# EAGLE design Shield (EAGLE 9.6.2)

## Sheet 1 of 2
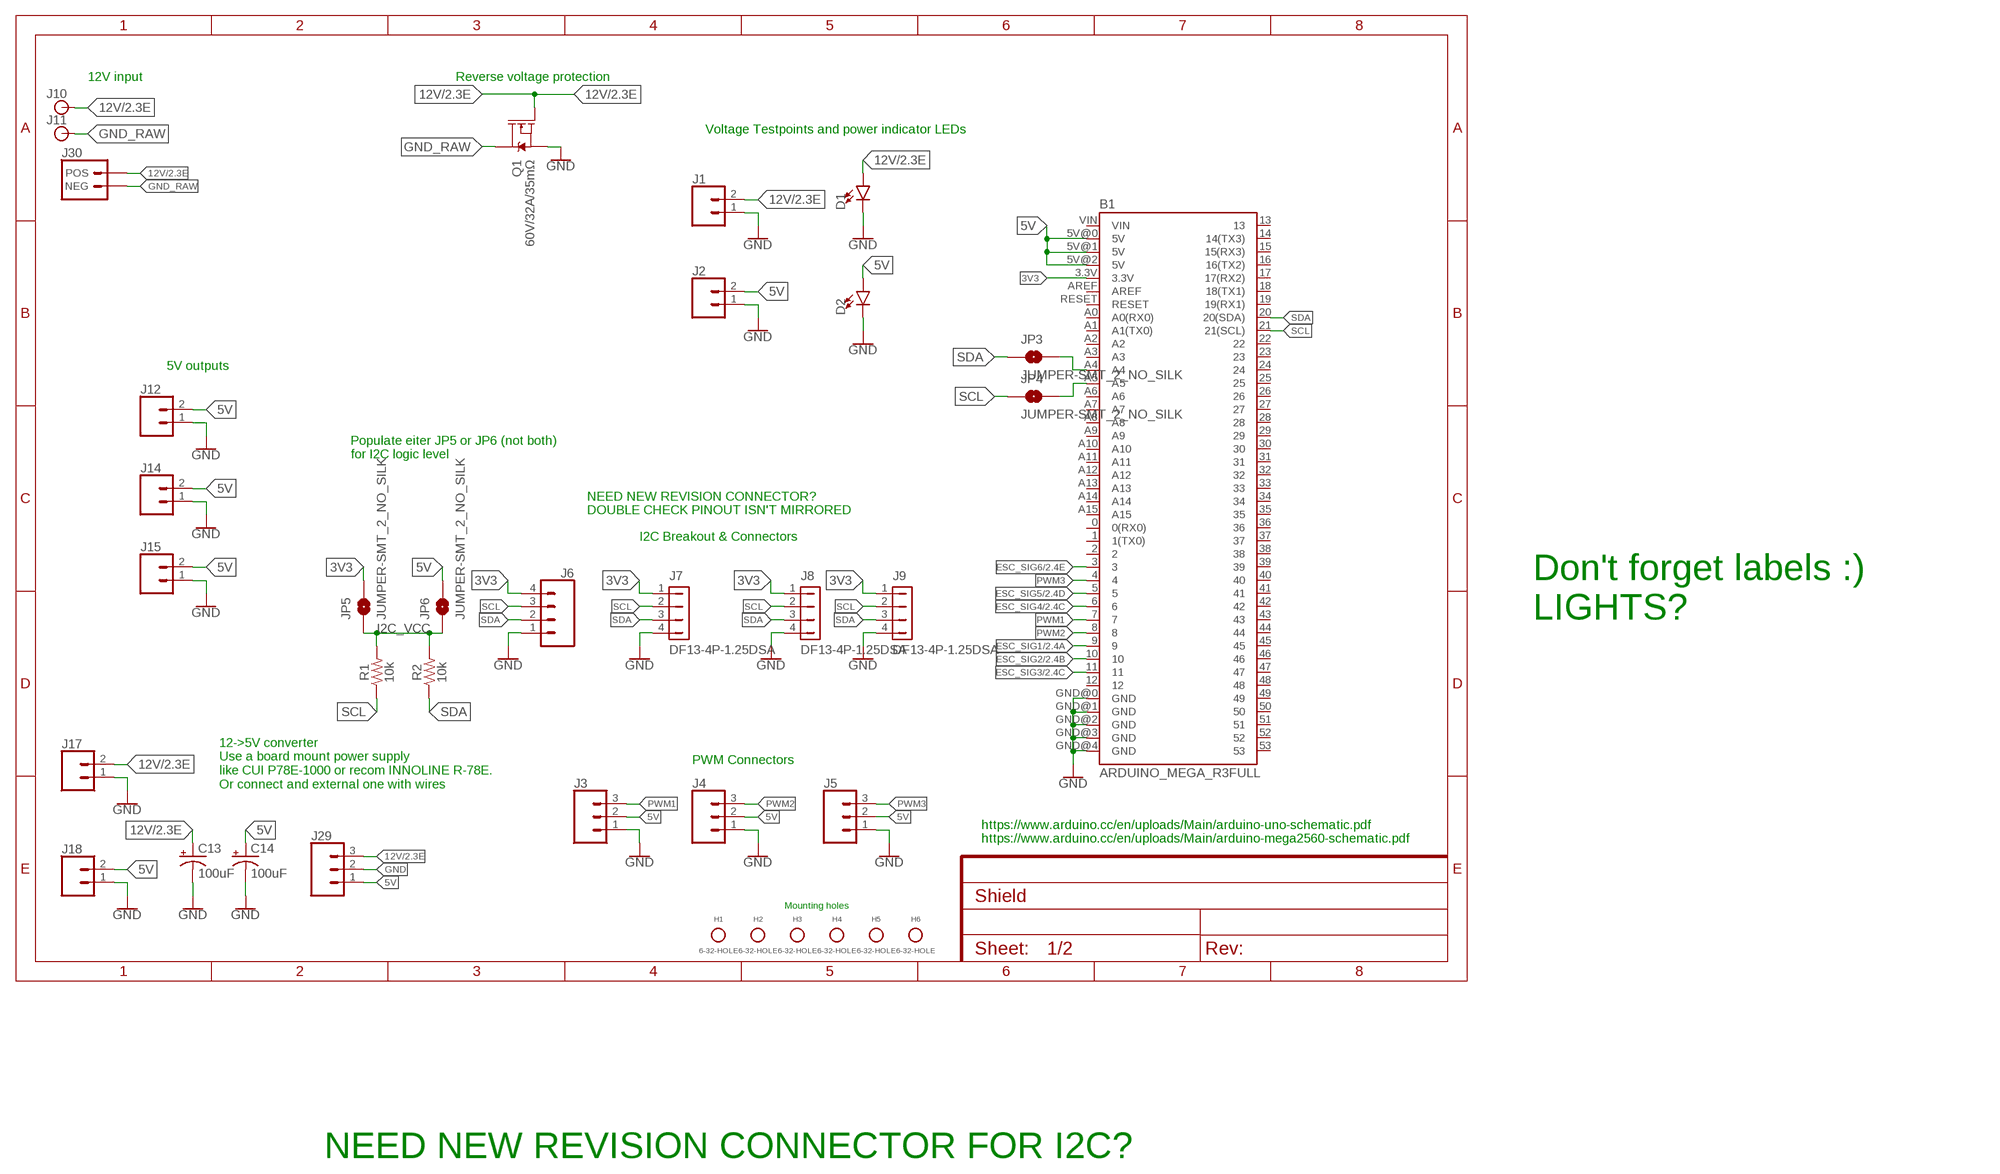
[diagram p0: schematic, sheet 1]

### Parts
B1  ARDUINO_MEGA_R3FULL  [ARDUINO_MEGA]
C13  100uF  100UF-POLAR-RADIAL-2.5MM-25V-20%  [CPOL-RADIAL-2.5MM-6.5MM]
C14  100uF  100UF-POLAR-RADIAL-2.5MM-25V-20%  [CPOL-RADIAL-2.5MM-6.5MM]
D1  LED3MM  [LED_3MM]
D2  LED3MM  [LED_3MM]
H1  6-32-HOLE  [6-32-HOLE]
H2  6-32-HOLE  [6-32-HOLE]
H3  6-32-HOLE  [6-32-HOLE]
H4  6-32-HOLE  [6-32-HOLE]
H5  6-32-HOLE  [6-32-HOLE]
H6  6-32-HOLE  [6-32-HOLE]
J1  CONN_02  [1X02]
J2  CONN_02  [1X02]
J3  CONN_03  [1X03]
J4  CONN_03  [1X03]
J5  CONN_03  [1X03]
J6  CONN_04  [1X04]
J7  DF13-4P-1.25DSA  [DF13-4P-1.25DSA]
J8  DF13-4P-1.25DSA  [DF13-4P-1.25DSA]
J9  DF13-4P-1.25DSA  [DF13-4P-1.25DSA]
J10  BANANA_PTH  [BANANA_CONN_NO_THERM]
J11  BANANA_PTH  [BANANA_CONN_NO_THERM]
J12  CONN_02  [1X02]
J14  CONN_02  [1X02]
J15  CONN_02  [1X02]
J17  CONN_02  [1X02]
J18  CONN_02  [1X02]
J29  CONN_03  [1X03]
J30  ANDERON_POWERPOLE_2  [ANDERON_POWERPOLE_2]
JP3  JUMPER-SMT_2_NO_SILK  [SMT-JUMPER_2_NO_SILK]
JP4  JUMPER-SMT_2_NO_SILK  [SMT-JUMPER_2_NO_SILK]
JP5  JUMPER-SMT_2_NO_SILK  [SMT-JUMPER_2_NO_SILK]
JP6  JUMPER-SMT_2_NO_SILK  [SMT-JUMPER_2_NO_SILK]
Q1  60V/32A/35mΩ  MOSFET-NCH-FQP30N06L  [TO220V]
R1  10k  10KOHM-HORIZ-1/4W-5%  [AXIAL-0.3]
R2  10k  10KOHM-HORIZ-1/4W-5%  [AXIAL-0.3]

### Nets
3V3 [power]: B1.3.3V J6.4 J7.1 J8.1 J9.1 JP5.2
5V [power]: B1.5V@0(5V) B1.5V@1(5V) B1.5V@2(5V) C14.1(+) D2.A J2.2 J3.2 J4.2 J5.2 J12.2 J14.2 J15.2 J18.2 J29.1 JP6.2
12V: C13.1(+) D1.A J1.2 J10.1 J17.2 J29.3 J30.POS Q1.1(G) ; also sheet 2
A4_SDA: B1.A4 JP3.2
A5_SCL: B1.A5 JP4.2
ESC_SIG1: B1.9 ; also sheet 2
ESC_SIG2: B1.10 ; also sheet 2
ESC_SIG3: B1.11 ; also sheet 2
ESC_SIG4: B1.6 ; also sheet 2
ESC_SIG5: B1.5 ; also sheet 2
ESC_SIG6: B1.3 ; also sheet 2
GND: B1.GND@0(GND) B1.GND@1(GND) B1.GND@2(GND) B1.GND@3(GND) B1.GND@4(GND) C13.2(-) C14.2(-) D1.K(C) D2.K(C) J1.1 J2.1 J3.1 J4.1 J5.1 J6.1 J7.4 J8.4 J9.4 J12.1 J14.1 J15.1 J17.1 J18.1 J29.2 Q1.3(S) ; also sheet 2
GND_RAW: J11.1 J30.NEG Q1.2(D)
I2C_VCC: JP5.1 JP6.1 R1.P$2 R2.P$2
PWM1: B1.7 J3.3
PWM2: B1.8 J4.3
PWM3: B1.4 J5.3
SCL: B1.21(21(SCL)) J6.3 J7.2 J8.2 J9.2 JP4.1 R1.P$1
SDA: B1.20(20(SDA)) J6.2 J7.3 J8.3 J9.3 JP3.1 R2.P$1
Unconnected: B1.0(0(RX0)) B1.1(1(TX0)) B1.2 B1.12 B1.13 B1.14(14(TX3)) B1.15(15(RX3)) B1.16(16(TX2)) B1.17(17(RX2)) B1.18(18(TX1)) B1.19(19(RX1)) B1.22 B1.23 B1.24 B1.25 B1.26 B1.27 B1.28 B1.29 B1.30 B1.31 B1.32 B1.33 B1.34 B1.35 B1.36 B1.37 B1.38 B1.39 B1.40 B1.41 B1.42 B1.43 B1.44 B1.45 B1.46 B1.47 B1.48 B1.49 B1.50 B1.51 B1.52 B1.53 B1.A0(A0(RX0)) B1.A1(A1(TX0)) B1.A2 B1.A3 B1.A6 B1.A7 B1.A8 B1.A9 B1.A10 B1.A11 B1.A12 B1.A13 B1.A14 B1.A15 B1.AREF B1.RESET B1.VIN

### Notes on the sheet
- 12V input | Reverse voltage protection
- Voltage Testpoints and power indicator LEDs
- 5V outputs
- Populate eiter JP5 or JP6 (not both)
  for I2C logic level
- NEED NEW REVISION CONNECTOR?
  DOUBLE CHECK PINOUT ISN'T MIRRORED
- I2C Breakout & Connectors
- Don't forget labels :)
  LIGHTS?
- 12->5V converter
  Use a board mount power supply
  like CUI P78E-1000 or recom INNOLINE R-78E.
  Or connect and external one with wires
- PWM Connectors
- https://www.arduino.cc/en/uploads/Main/arduino-uno-schematic.pdf
  https://www.arduino.cc/en/uploads/Main/arduino-mega2560-schematic.pdf
- Mounting holes
- NEED NEW REVISION CONNECTOR FOR I2C?

## Sheet 2 of 2
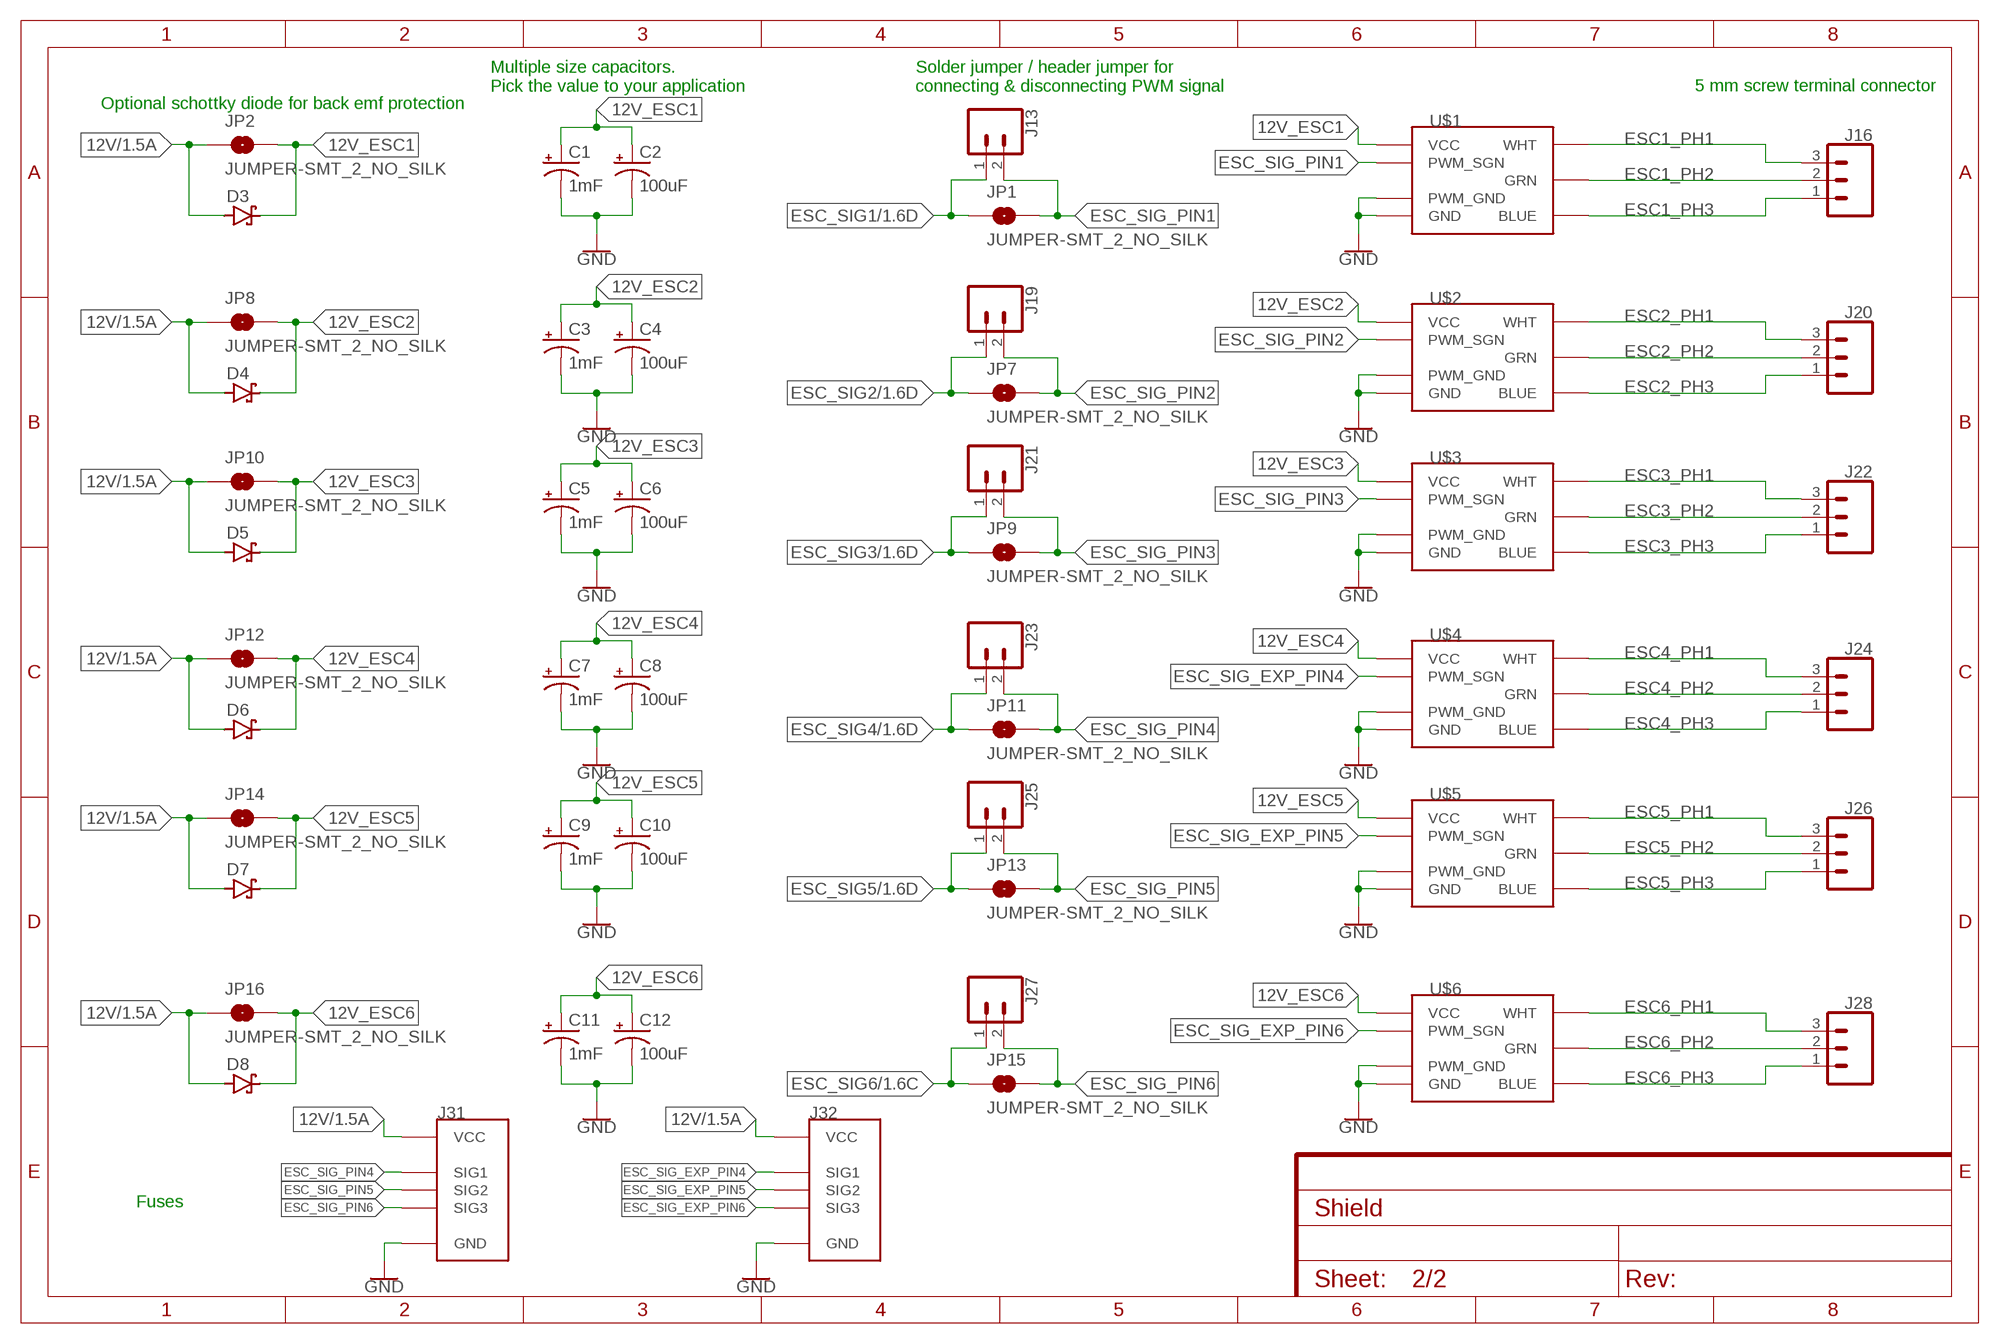
[diagram p1: schematic, sheet 2]

### Parts
C1  1mF  1000UF-RADIAL-5MM-25V-20%  [CPOL-RADIAL-5MM-10MM]
C2  100uF  100UF-POLAR-RADIAL-2.5MM-25V-20%  [CPOL-RADIAL-2.5MM-6.5MM]
C3  1mF  1000UF-RADIAL-5MM-25V-20%  [CPOL-RADIAL-5MM-10MM]
C4  100uF  100UF-POLAR-RADIAL-2.5MM-25V-20%  [CPOL-RADIAL-2.5MM-6.5MM]
C5  1mF  1000UF-RADIAL-5MM-25V-20%  [CPOL-RADIAL-5MM-10MM]
C6  100uF  100UF-POLAR-RADIAL-2.5MM-25V-20%  [CPOL-RADIAL-2.5MM-6.5MM]
C7  1mF  1000UF-RADIAL-5MM-25V-20%  [CPOL-RADIAL-5MM-10MM]
C8  100uF  100UF-POLAR-RADIAL-2.5MM-25V-20%  [CPOL-RADIAL-2.5MM-6.5MM]
C9  1mF  1000UF-RADIAL-5MM-25V-20%  [CPOL-RADIAL-5MM-10MM]
C10  100uF  100UF-POLAR-RADIAL-2.5MM-25V-20%  [CPOL-RADIAL-2.5MM-6.5MM]
C11  1mF  1000UF-RADIAL-5MM-25V-20%  [CPOL-RADIAL-5MM-10MM]
C12  100uF  100UF-POLAR-RADIAL-2.5MM-25V-20%  [CPOL-RADIAL-2.5MM-6.5MM]
D3  SCHOTTKY-DIODECB429-15  [CB429-15]
D4  SCHOTTKY-DIODECB429-15  [CB429-15]
D5  SCHOTTKY-DIODECB429-15  [CB429-15]
D6  SCHOTTKY-DIODECB429-15  [CB429-15]
D7  SCHOTTKY-DIODECB429-15  [CB429-15]
D8  SCHOTTKY-DIODECB429-15  [CB429-15]
J13  CONN_02  [1X02]
J16  CONN_03-SCREW-5MM  [SCREWTERMINAL-5MM-3]
J19  CONN_02  [1X02]
J20  CONN_03-SCREW-5MM  [SCREWTERMINAL-5MM-3]
J21  CONN_02  [1X02]
J22  CONN_03-SCREW-5MM  [SCREWTERMINAL-5MM-3]
J23  CONN_02  [1X02]
J24  CONN_03-SCREW-5MM  [SCREWTERMINAL-5MM-3]
J25  CONN_02  [1X02]
J26  CONN_03-SCREW-5MM  [SCREWTERMINAL-5MM-3]
J27  CONN_02  [1X02]
J28  CONN_03-SCREW-5MM  [SCREWTERMINAL-5MM-3]
J31  ESC_EXPANSION_CONNECTOR  [EXPANSION]
J32  ESC_EXPANSION_CONNECTOR  [EXPANSION]
JP1  JUMPER-SMT_2_NO_SILK  [SMT-JUMPER_2_NO_SILK]
JP2  JUMPER-SMT_2_NO_SILK  [SMT-JUMPER_2_NO_SILK]
JP7  JUMPER-SMT_2_NO_SILK  [SMT-JUMPER_2_NO_SILK]
JP8  JUMPER-SMT_2_NO_SILK  [SMT-JUMPER_2_NO_SILK]
JP9  JUMPER-SMT_2_NO_SILK  [SMT-JUMPER_2_NO_SILK]
JP10  JUMPER-SMT_2_NO_SILK  [SMT-JUMPER_2_NO_SILK]
JP11  JUMPER-SMT_2_NO_SILK  [SMT-JUMPER_2_NO_SILK]
JP12  JUMPER-SMT_2_NO_SILK  [SMT-JUMPER_2_NO_SILK]
JP13  JUMPER-SMT_2_NO_SILK  [SMT-JUMPER_2_NO_SILK]
JP14  JUMPER-SMT_2_NO_SILK  [SMT-JUMPER_2_NO_SILK]
JP15  JUMPER-SMT_2_NO_SILK  [SMT-JUMPER_2_NO_SILK]
JP16  JUMPER-SMT_2_NO_SILK  [SMT-JUMPER_2_NO_SILK]
U$1  ESC  [ESC]
U$2  ESC  [ESC]
U$3  ESC  [ESC]
U$4  ESC  [ESC]
U$5  ESC  [ESC]
U$6  ESC  [ESC]

### Nets
12V: D3.A D4.A D5.A D6.A D7.A D8.A J31.15(VCC) J31.16(VCC) J31.17(VCC) J31.18(VCC) J31.19(VCC) J31.20(VCC) J31.21(VCC) J31.22(VCC) J31.23(VCC) J31.24(VCC) J32.15(VCC) J32.16(VCC) J32.17(VCC) J32.18(VCC) J32.19(VCC) J32.20(VCC) J32.21(VCC) J32.22(VCC) J32.23(VCC) J32.24(VCC) JP2.1 JP8.1 JP10.1 JP12.1 JP14.1 JP16.1 ; also sheet 1
12V_ESC1: C1.+ C2.1(+) D3.C JP2.2 U$1.VCC
12V_ESC2: C3.+ C4.1(+) D4.C JP8.2 U$2.VCC
12V_ESC3: C5.+ C6.1(+) D5.C JP10.2 U$3.VCC
12V_ESC4: C7.+ C8.1(+) D6.C JP12.2 U$4.VCC
12V_ESC5: C9.+ C10.1(+) D7.C JP14.2 U$5.VCC
12V_ESC6: C11.+ C12.1(+) D8.C JP16.2 U$6.VCC
ESC1_PH1: J16.3 U$1.BLUE(WHT)
ESC1_PH2: J16.2 U$1.GRN
ESC1_PH3: J16.1 U$1.WHT(BLUE)
ESC2_PH1: J20.3 U$2.BLUE(WHT)
ESC2_PH2: J20.2 U$2.GRN
ESC2_PH3: J20.1 U$2.WHT(BLUE)
ESC3_PH1: J22.3 U$3.BLUE(WHT)
ESC3_PH2: J22.2 U$3.GRN
ESC3_PH3: J22.1 U$3.WHT(BLUE)
ESC4_PH1: J24.3 U$4.BLUE(WHT)
ESC4_PH2: J24.2 U$4.GRN
ESC4_PH3: J24.1 U$4.WHT(BLUE)
ESC5_PH1: J26.3 U$5.BLUE(WHT)
ESC5_PH2: J26.2 U$5.GRN
ESC5_PH3: J26.1 U$5.WHT(BLUE)
ESC6_PH1: J28.3 U$6.BLUE(WHT)
ESC6_PH2: J28.2 U$6.GRN
ESC6_PH3: J28.1 U$6.WHT(BLUE)
ESC_SIG1: J13.1 JP1.1 ; also sheet 1
ESC_SIG2: J19.1 JP7.1 ; also sheet 1
ESC_SIG3: J21.1 JP9.1 ; also sheet 1
ESC_SIG4: J23.1 JP11.1 ; also sheet 1
ESC_SIG5: J25.1 JP13.1 ; also sheet 1
ESC_SIG6: J27.1 JP15.1 ; also sheet 1
ESC_SIG_EXP_PIN4: J32.11(SIG1) U$4.PWM_SGN
ESC_SIG_EXP_PIN5: J32.12(SIG2) U$5.PWM_SGN
ESC_SIG_EXP_PIN6: J32.13(SIG3) U$6.PWM_SGN
ESC_SIG_PIN1: J13.2 JP1.2 U$1.PWM_SGN
ESC_SIG_PIN2: J19.2 JP7.2 U$2.PWM_SGN
ESC_SIG_PIN3: J21.2 JP9.2 U$3.PWM_SGN
ESC_SIG_PIN4: J23.2 J31.11(SIG1) JP11.2
ESC_SIG_PIN5: J25.2 J31.12(SIG2) JP13.2
ESC_SIG_PIN6: J27.2 J31.13(SIG3) JP15.2
GND: C1.- C2.2(-) C3.- C4.2(-) C5.- C6.2(-) C7.- C8.2(-) C9.- C10.2(-) C11.- C12.2(-) J31.1(GND) J31.2(GND) J31.3(GND) J31.4(GND) J31.5(GND) J31.6(GND) J31.7(GND) J31.8(GND) J31.9(GND) J31.10(GND) J32.1(GND) J32.2(GND) J32.3(GND) J32.4(GND) J32.5(GND) J32.6(GND) J32.7(GND) J32.8(GND) J32.9(GND) J32.10(GND) U$1.GND U$1.PWM_GND U$2.GND U$2.PWM_GND U$3.GND U$3.PWM_GND U$4.GND U$4.PWM_GND U$5.GND U$5.PWM_GND U$6.GND U$6.PWM_GND ; also sheet 1

### Notes on the sheet
- Multiple size capacitors.
  Pick the value to your application
- Solder jumper / header jumper for
  connecting & disconnecting PWM signal
- 5 mm screw terminal connector
- Optional schottky diode for back emf protection
- Fuses

## Library data of the parts
B1 = SparkFun-Boards:ARDUINO_MEGA_R3: Arduino Mega R3 ATmega2560 R3 compatible footprint. SparkFun Products: Arduino Mega 2560 R3 <https://www.sparkfun.com/products/11061>
C1 C3 C5 C7 C9 C11 = SparkFun-Capacitors:1000UF: 1,000µF/1mF ceramic capacitors A capacitor is a passive two-terminal electrical component used to store electrical energy temporarily in an electric field. CAP-08070; PROD_ID: CAP-09538
C2 C4 C6 C8 C10 C12-C14 = SparkFun-Capacitors:100UF-POLAR: 100µF polarized capacitors A capacitor is a passive two-terminal electrical component used to store electrical energy temporarily in an electric field.; PROD_ID: CAP-08439
D1 D2 = SparkFun-LED:LED: LED (Generic) Standard schematic elements and footprints for 5mm, 3mm, 1206, and 0603 sized LEDs. Generic LEDs with no color specified.; PROD_ID: DIO-08794
D3-D8 = diode:SCHOTTKY-DIODE: Schottky Diode
H1-H6 = Mounting Holes:6-32-HOLE
J1 J2 J12-J15 J17-J19 J21 J23 J25 J27 = SparkFun-Connectors:CONN_02: Multi connection point. Often used as Generic Header-pin footprint for 0.1 inch spaced/style header connections On any of the 0.1 inch spaced packages, you can populate with these: Break Away Headers - Straight <https://www.sparkfun.com/products/116> (PRT-00116) Break Away Male Headers - Right Angle <https://www.sparkfun.com/products/553> (PRT-00553) Female Headers <https://www.sparkfun.com/products/115> (PRT-00115) Break Away Headers - Machine Pin <https://www.sparkfun.com/products/117> (PRT-00117) Break Away Female Headers - Swiss Machine Pin <https://www.sparkfun.com/products/743> (PRT-00743) For SCREWTERMINALS and SPRING TERMINALS visit here: Screw Terimnals on SparkFun.com <https://www.sparkfun.com/search/results?term=Screw+Terminals> (5mm/3.5mm/2.54mm spacing) This device is also useful as a general connection point to wire up your design to another part of your project. Our various solder wires solder well into these plated through hole pads. Hook-Up Wire - Assortment (Stranded, 22 AWG) <https://www.sparkfun.com/products/11375> (PRT-11375) Hook-Up Wire - Assortment (Solid Core, 22 AWG) <https://www.sparkfun.com/products/11367> (PRT-11367) View the entire wire category on our website here <https://www.sparkfun.com/categories/141> Special notes: Molex polarized connector foot print use with: PRT-08233 with associated crimp pins and housings. 2.54_SCREWTERM for use with PRT-10571. 3.5mm Screw Terminal footprints for PRT-08084 5mm Screw Terminal footprints for use with PRT-08432
J3-J5 J29 = SparkFun-Connectors:CONN_03: Multi connection point. Often used as Generic Header-pin footprint for 0.1 inch spaced/style header connections On any of the 0.1 inch spaced packages, you can populate with these: Break Away Headers - Straight <https://www.sparkfun.com/products/116> (PRT-00116) Break Away Male Headers - Right Angle <https://www.sparkfun.com/products/553> (PRT-00553) Female Headers <https://www.sparkfun.com/products/115> (PRT-00115) Break Away Headers - Machine Pin <https://www.sparkfun.com/products/117> (PRT-00117) Break Away Female Headers - Swiss Machine Pin <https://www.sparkfun.com/products/743> (PRT-00743) Stackable Header - 3 Pin (Female, 0.1") <https://www.sparkfun.com/products/13875> (PRT-13875) For SCREWTERMINALS and SPRING TERMINALS visit here: Screw Terimnals on SparkFun.com <https://www.sparkfun.com/search/results?term=Screw+Terminals> (5mm/3.5mm/2.54mm spacing) This device is also useful as a general connection point to wire up your design to another part of your project. Our various solder wires solder well into these plated through hole pads. Hook-Up Wire - Assortment (Stranded, 22 AWG) <https://www.sparkfun.com/products/11375> (PRT-11375) Hook-Up Wire - Assortment (Solid Core, 22 AWG) <https://www.sparkfun.com/products/11367> (PRT-11367) View the entire wire category on our website here <https://www.sparkfun.com/categories/141> Special notes: Molex polarized connector foot print use with SKU : PRT-08232 with associated crimp pins and housings.
J6 = SparkFun-Connectors:CONN_04: Multi connection point. Often used as Generic Header-pin footprint for 0.1 inch spaced/style header connections On any of the 0.1 inch spaced packages, you can populate with these: Break Away Headers - Straight <https://www.sparkfun.com/products/116> (PRT-00116) Break Away Male Headers - Right Angle <https://www.sparkfun.com/products/553> (PRT-00553) Female Headers <https://www.sparkfun.com/products/115> (PRT-00115) Break Away Headers - Machine Pin <https://www.sparkfun.com/products/117> (PRT-00117) Break Away Female Headers - Swiss Machine Pin <https://www.sparkfun.com/products/743> (PRT-00743) For SCREWTERMINALS and SPRING TERMINALS visit here: Screw Terimnals on SparkFun.com <https://www.sparkfun.com/search/results?term=Screw+Terminals> (5mm/3.5mm/2.54mm spacing) This device is also useful as a general connection point to wire up your design to another part of your project. Our various solder wires solder well into these plated through hole pads. Hook-Up Wire - Assortment (Stranded, 22 AWG) <https://www.sparkfun.com/products/11375> (PRT-11375) Hook-Up Wire - Assortment (Solid Core, 22 AWG) <https://www.sparkfun.com/products/11367> (PRT-11367) View the entire wire category on our website here <https://www.sparkfun.com/categories/141> Special notes: Molex polarized connector foot print use with SKU : PRT-08231 with associated crimp pins and housings. 1MM SMD Version SKU: PRT-10208; PROD_ID: CONN-09696
J7-J9 = con-hirose-df13:DF13-4P-1.25: DF13-4P 1.25mm Pitch Miniature Crimping Connector.
J10 J11 = Banana Plug PTH:BANANA_PTH
J16 J20 J22 J24 J26 J28 = SparkFun-Connectors:CONN_03: Multi connection point. Often used as Generic Header-pin footprint for 0.1 inch spaced/style header connections On any of the 0.1 inch spaced packages, you can populate with these: Break Away Headers - Straight <https://www.sparkfun.com/products/116> (PRT-00116) Break Away Male Headers - Right Angle <https://www.sparkfun.com/products/553> (PRT-00553) Female Headers <https://www.sparkfun.com/products/115> (PRT-00115) Break Away Headers - Machine Pin <https://www.sparkfun.com/products/117> (PRT-00117) Break Away Female Headers - Swiss Machine Pin <https://www.sparkfun.com/products/743> (PRT-00743) Stackable Header - 3 Pin (Female, 0.1") <https://www.sparkfun.com/products/13875> (PRT-13875) For SCREWTERMINALS and SPRING TERMINALS visit here: Screw Terimnals on SparkFun.com <https://www.sparkfun.com/search/results?term=Screw+Terminals> (5mm/3.5mm/2.54mm spacing) This device is also useful as a general connection point to wire up your design to another part of your project. Our various solder wires solder well into these plated through hole pads. Hook-Up Wire - Assortment (Stranded, 22 AWG) <https://www.sparkfun.com/products/11375> (PRT-11375) Hook-Up Wire - Assortment (Solid Core, 22 AWG) <https://www.sparkfun.com/products/11367> (PRT-11367) View the entire wire category on our website here <https://www.sparkfun.com/categories/141> Special notes: Molex polarized connector foot print use with SKU : PRT-08232 with associated crimp pins and housings.; PROD_ID: CONN-10134; SF_SKU: PRT-08433
J30 = Anderson PP:ANDERON_POWERPOLE_2
J31 J32 = Esc Expansion:ESC_EXPANSION_CONNECTOR
JP1-JP16 = SparkFun-Jumpers:JUMPER-SMT_2_NO: Normally open jumper This jumper has two pads in close proximity to each other. Apply solder to close the connection. Round pads are easier to solder for beginners, but are a lot larger. SparkFun Product that uses the round pads: SparkFun EL Sequencer <https://www.sparkfun.com/products/12781>
Q1 = SparkFun-DiscreteSemi:MOSFET-NCH: N-channel MOSFETs Voltage controlled devices that allow control of high current outputs. SparkFun Products: SparkFun OpenScale <https://www.sparkfun.com/products/13261> SparkFun Digital Sandbox <https://www.sparkfun.com/products/12651> SparkFun Monster Moto Shield <https://www.sparkfun.com/products/10182> SparkFun MOSFET Power Controller <https://www.sparkfun.com/products/11214>; PROD_ID: TRANS-10060
R1 R2 = SparkFun-Resistors:10KOHM: 10kΩ resistor A resistor is a passive two-terminal electrical component that implements electrical resistance as a circuit element. Resistors act to reduce current flow, and, at the same time, act to lower voltage levels within circuits. - Wikipedia; PROD_ID: RES-09435
U$1-U$6 = ESC:ESC

## Net classes
0 default: width 0.254 mm, clearance 0.254 mm
1 power: width 0.762 mm, clearance 0.254 mm

## Board
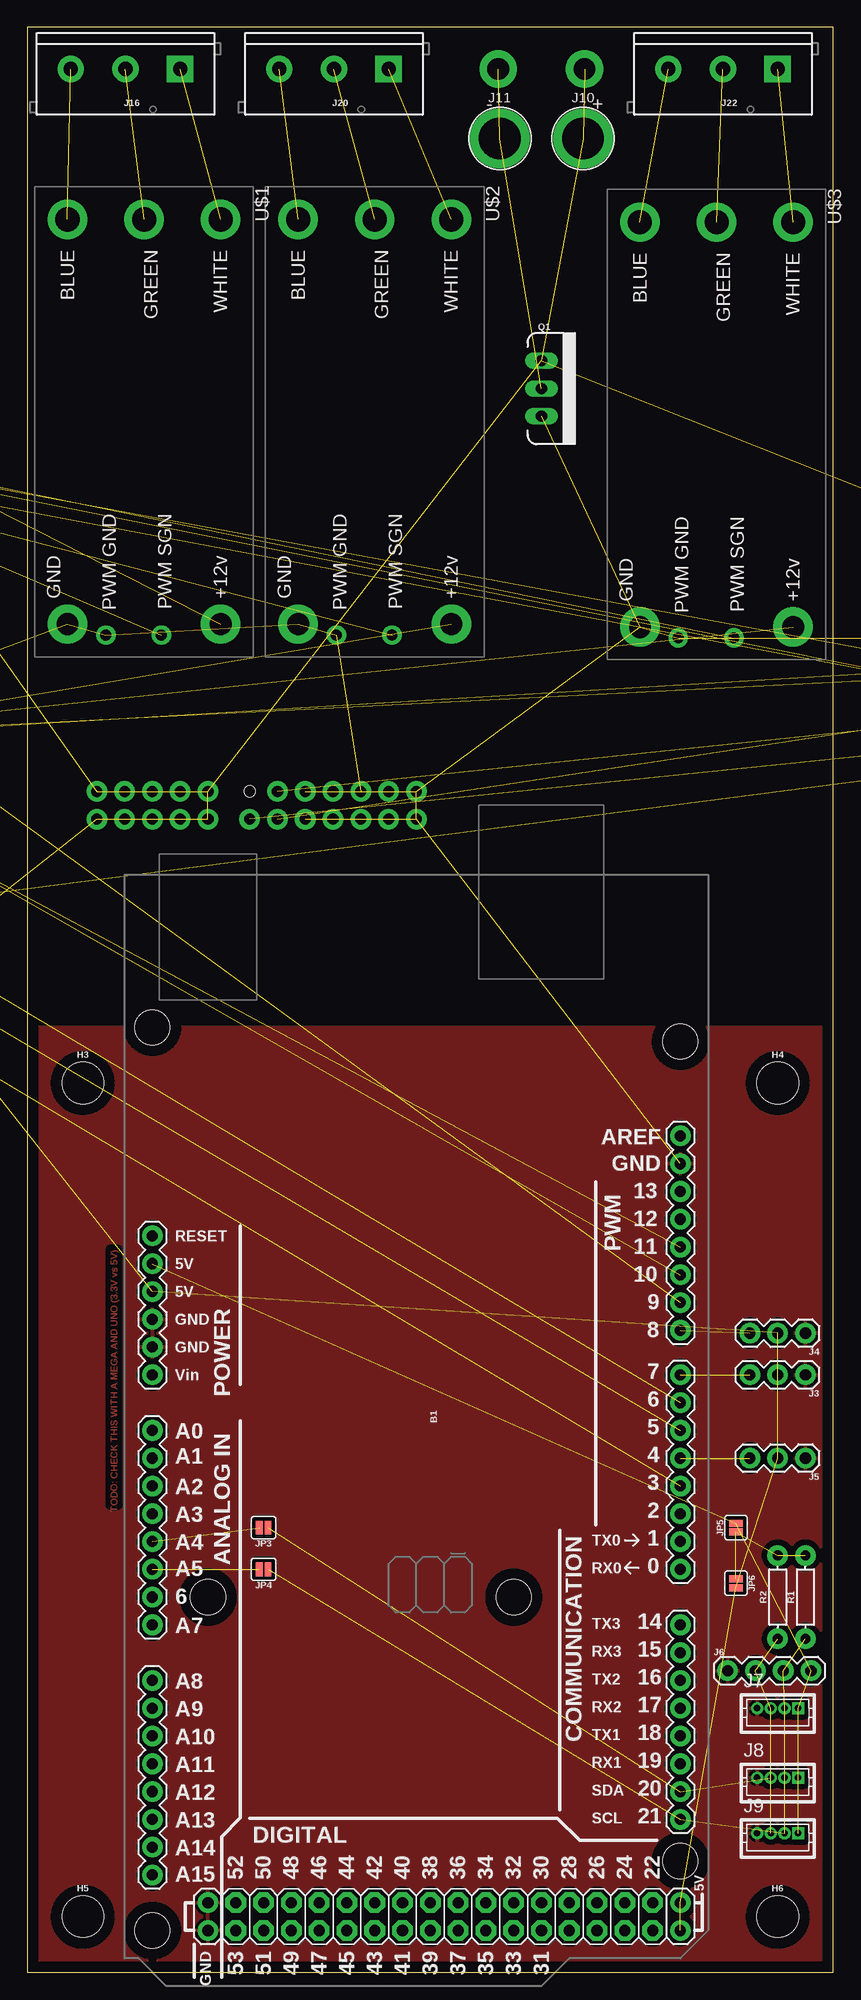
[diagram p2: board, top side]
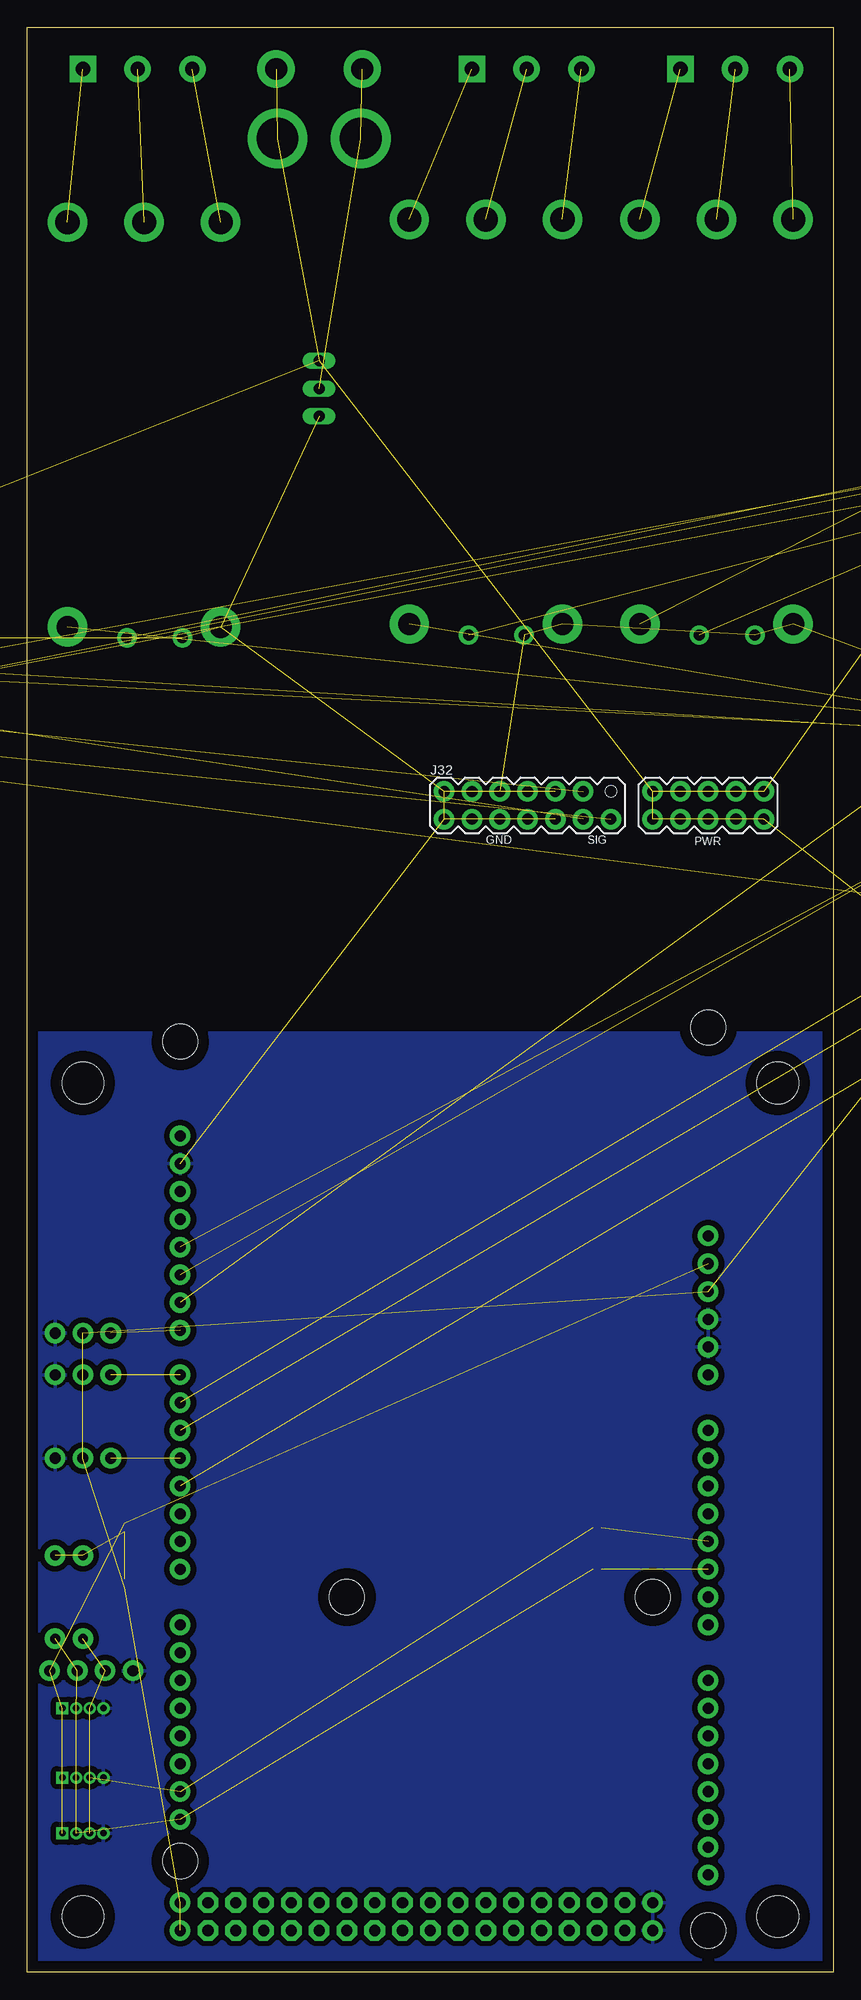
[diagram p3: board, bottom side, seen from below]

Size 73.66 x 177.8 mm. Coordinates in mm from the lower left corner, seen from the top.
Outline: 0,0 73.66,0 73.66,177.8 0,177.8 0,0
Copper layers (1*16): Top 0.035mm / dielectric 1.5mm / Bottom 0.035mm
Design rules "default": minimum track width 6mil, minimum drill 0.35mm, track to track 6mil, track to pad 6mil, pad to pad 6mil, via to via 6mil, smd to smd 6mil, copper to edge 40mil, drill to drill 6mil, minimum pad ring 10mil, minimum via ring 8mil, stop-mask expansion 4mil, vias tented up to drill 0mil, thermal gap 10mil

### Footprints (pad centres in the part's own frame; a part is rotated, then mirrored left to right if it is on the bottom)
ARDUINO_MEGA = drill 1.016 pad 1.88: 0 13.97,24.13; 1 11.43,24.13; 2 8.89,24.13; 3 6.35,24.13; 3.3V -13.97,-24.13; 4 3.81,24.13; 5 1.27,24.13; 5V@0 -11.43,-24.13; 5V@1 44.45,24.13; 5V@2 46.99,24.13; 6 -1.27,24.13; 7 -3.81,24.13; 8 -7.874,24.13; 9 -10.414,24.13; 10 -12.954,24.13; 11 -15.494,24.13; 12 -18.034,24.13; 13 -20.574,24.13; 14 19.05,24.13; 15 21.59,24.13; 16 24.13,24.13; 17 26.67,24.13; 18 29.21,24.13; 19 31.75,24.13; 20 34.29,24.13; 21 36.83,24.13; A0 1.27,-24.13; A1 3.81,-24.13; A2 6.35,-24.13; A3 8.89,-24.13; A4 11.43,-24.13; A5 13.97,-24.13; A6 16.51,-24.13; A7 19.05,-24.13; A8 24.13,-24.13; A9 26.67,-24.13; A10 29.21,-24.13; A11 31.75,-24.13; A12 34.29,-24.13; A13 36.83,-24.13; A14 39.37,-24.13; A15 41.91,-24.13; AREF -25.654,24.13; GND@0 -8.89,-24.13; GND@1 -6.35,-24.13; GND@2 44.45,-19.05; GND@3 46.99,-19.05; GND@4 -23.114,24.13; RESET -16.51,-24.13; VIN -3.81,-24.13 | drill 1.016 pad 1.88 octagon: 22 44.45,21.59; 23 46.99,21.59; 24 44.45,19.05; 25 46.99,19.05; 26 44.45,16.51; 27 46.99,16.51; 28 44.45,13.97; 29 46.99,13.97; 30 44.45,11.43; 31 46.99,11.43; 32 44.45,8.89; 33 46.99,8.89; 34 44.45,6.35; 35 46.99,6.35; 36 44.45,3.81; 37 46.99,3.81; 38 44.45,1.27; 39 46.99,1.27; 40 44.45,-1.27; 41 46.99,-1.27; 42 44.45,-3.81; 43 46.99,-3.81; 44 44.45,-6.35; 45 46.99,-6.35; 46 44.45,-8.89; 47 46.99,-8.89; 48 44.45,-11.43; 49 46.99,-11.43; 50 44.45,-13.97; 51 46.99,-13.97; 52 44.45,-16.51; 53 46.99,-16.51 | hole 3.2: -34.29,24.13; -35.56,-24.13; 16.51,8.89; 16.51,-19.05; 40.64,24.13; 46.99,-24.13
CPOL-RADIAL-5MM-10MM = drill 0.9 pad 1.93 square: + 2.5,0 | drill 0.9 pad 1.93: - -2.5,0
CPOL-RADIAL-2.5MM-6.5MM = drill 0.7 pad 1.651 square: 1 1.25,0 | drill 0.7 pad 1.651: 2 -1.25,0
LED_3MM = drill 0.813 pad 1.88: A -1.27,0; K 1.27,0
CB429-15 = drill 1.397 long: A 7.62,0; C -7.62,0
6-32-HOLE = hole 3.81: 0,0
1X02 = drill 1.016 pad 1.88: 1 0,0; 2 2.54,0
1X03 = drill 1.016 pad 1.88: 1 0,0; 2 2.54,0; 3 5.08,0
1X04 = drill 1.016 pad 1.88: 1 0,0; 2 2.54,0; 3 5.08,0; 4 7.62,0
DF13-4P-1.25DSA = drill 0.6 pad 1.016 square: 1 1.875,0 | drill 0.6 pad 1.016: 2 0.625,0; 3 -0.625,0; 4 -1.875,0
BANANA_CONN_NO_THERM = drill 3.81 pad 5.461: 1 0,0
SCREWTERMINAL-5MM-3 = drill 1.3 pad 2.413 square: 1 0,0 | drill 1.3 pad 2.413: 2 5,0; 3 10,0
ANDERON_POWERPOLE_2 = drill 2 pad 3.4: NEG 0,3.937; POS 0,-3.937
EXPANSION = drill 1.016 pad 1.88: 1 0,0; 2 0,2.54; 3 2.54,0; 4 2.54,2.54; 5 5.08,0; 6 5.08,2.54; 7 7.62,0; 8 7.62,2.54; 9 10.16,0; 10 10.16,2.54; 11 12.7,0; 12 12.7,2.54; 13 15.24,0; 15 19.05,0; 16 19.05,2.54; 17 21.59,0; 18 21.59,2.54; 19 24.13,0; 20 24.13,2.54; 21 26.67,0; 22 26.67,2.54; 23 29.21,0; 24 29.21,2.54 | hole 1.016: 15.24,2.54
SMT-JUMPER_2_NO_SILK = smd 0.635 x 1.27: 1 -0.406,0; 2 0.406,0
TO220V = drill 1.016 long: 1 -2.54,0; 2 0,0; 3 2.54,0
AXIAL-0.3 = drill 0.9 pad 1.88: P$1 -3.81,0; P$2 3.81,0
ESC = drill 2.2 pad 3.6: BLUE -18,-7; GRN -18,0; WHT -18,7 | drill 2 pad 3.6: GND 19,-7; VCC 19,7 | drill 1 pad 1.778: PWM_GND 20,-3.5; PWM_SGN 20,1.58

### Placement (x,y rotation side)
B1  35.56,50.8 270 top
C1  -27.94,110.49 0 top  (outside the outline)
C2  -93.98,107.95 0 top  (outside the outline)
C3  -39.37,110.49 0 top  (outside the outline)
C4  -101.6,107.95 0 top  (outside the outline)
C5  -50.8,110.49 0 top  (outside the outline)
C6  -109.22,107.95 0 top  (outside the outline)
C7  -62.23,110.49 0 top  (outside the outline)
C8  -116.84,107.95 0 top  (outside the outline)
C9  -73.66,110.49 0 top  (outside the outline)
C10  -124.46,107.95 0 top  (outside the outline)
C11  -85.09,110.49 0 top  (outside the outline)
C12  -132.08,107.95 0 top  (outside the outline)
C13  -55.88,186.69 0 top  (outside the outline)
C14  -55.88,177.8 0 top  (outside the outline)
D1  -52.07,152.4 0 top  (outside the outline)
D2  -58.42,152.4 0 top  (outside the outline)
D3  -22.86,138.43 0 top  (outside the outline)
D4  -43.18,138.43 0 top  (outside the outline)
D5  -63.5,138.43 0 top  (outside the outline)
D6  -83.82,138.43 0 top  (outside the outline)
D7  -104.14,138.43 0 top  (outside the outline)
D8  -19.05,91.44 0 top  (outside the outline)
H1  -5.08,173.99 0 top  (outside the outline)
H2  83.82,175.26 0 top  (outside the outline)
H3  5.08,81.28 0 top
H4  68.58,81.28 0 top
H5  5.08,5.08 0 top
H6  68.58,5.08 0 top
J1  -53.34,157.48 0 top  (outside the outline)
J2  -59.69,157.48 0 top  (outside the outline)
J3  71.12,54.61 180 top
J4  71.12,58.42 180 top
J5  71.12,46.99 180 top
J6  64.01,27.56 0 top
J7  68.58,24.13 0 top
J8  68.58,17.78 0 top
J9  68.58,12.7 0 top
J10  50.8,167.64 0 top
J11  43.18,167.64 0 top
J12  -90.17,182.88 0 top  (outside the outline)
J13  -72.39,157.48 0 top  (outside the outline)
J14  -90.17,179.07 0 top  (outside the outline)
J15  -90.17,175.26 0 top  (outside the outline)
J16  13.97,173.99 180 top
J17  -46.99,182.88 0 top  (outside the outline)
J18  -46.99,186.69 0 top  (outside the outline)
J19  -104.14,157.48 0 top  (outside the outline)
J20  33.02,173.99 180 top
J21  -110.49,157.48 0 top  (outside the outline)
J22  68.58,173.99 180 top
J23  -116.84,157.48 0 top  (outside the outline)
J24  128.27,167.64 180 top  (outside the outline)
J25  -123.19,157.48 0 top  (outside the outline)
J26  151.13,167.64 180 top  (outside the outline)
J27  -129.54,157.48 0 top  (outside the outline)
J28  177.8,168.91 180 top  (outside the outline)
J29  -44.45,179.07 0 top  (outside the outline)
J30  46.99,173.99 90 top
J31  120.65,107.95 0 top  (outside the outline)
J32  35.56,105.41 0 bottom
JP1  -71.12,161.29 0 top  (outside the outline)
JP2  -21.59,143.51 180 top  (outside the outline)
JP3  21.59,40.64 180 top
JP4  21.59,36.83 180 top
JP5  64.77,40.64 90 top
JP6  64.77,35.56 270 top
JP7  -102.87,161.29 0 top  (outside the outline)
JP8  -43.18,143.51 180 top  (outside the outline)
JP9  -109.22,161.29 0 top  (outside the outline)
JP10  -63.5,142.24 0 top  (outside the outline)
JP11  -115.57,161.29 0 top  (outside the outline)
JP12  -83.82,142.24 180 top  (outside the outline)
JP13  -121.92,161.29 0 top  (outside the outline)
JP14  -104.14,143.51 180 top  (outside the outline)
JP15  -128.27,161.29 0 top  (outside the outline)
JP16  -19.05,96.52 180 top  (outside the outline)
Q1  46.99,144.78 270 top
R1  71.12,34.29 90 top
R2  68.58,34.29 90 top
U$1  10.67,142.24 270 top
U$2  31.75,142.24 270 top
U$3  62.99,141.99 270 top
U$4  123.19,140.97 270 top  (outside the outline)
U$5  146.05,140.97 270 top  (outside the outline)
U$6  170.18,140.97 270 top  (outside the outline)

### Tracks (layer width: path | path; a pad name or v marks a point on that pad's centre or on a via)
3V3  (5 unrouted)
5V  (14 unrouted)
12V  (39 unrouted)
12V_ESC1  (4 unrouted)
12V_ESC2  (4 unrouted)
12V_ESC3  (4 unrouted)
12V_ESC4  (4 unrouted)
12V_ESC5  (4 unrouted)
12V_ESC6  (4 unrouted)
A4_SDA  (1 unrouted)
A5_SCL  (1 unrouted)
ESC1_PH1  (1 unrouted)
ESC1_PH2  (1 unrouted)
ESC1_PH3  (1 unrouted)
ESC2_PH1  (1 unrouted)
ESC2_PH2  (1 unrouted)
ESC2_PH3  (1 unrouted)
ESC3_PH1  (1 unrouted)
ESC3_PH2  (1 unrouted)
ESC3_PH3  (1 unrouted)
ESC4_PH1  (1 unrouted)
ESC4_PH2  (1 unrouted)
ESC4_PH3  (1 unrouted)
ESC5_PH1  (1 unrouted)
ESC5_PH2  (1 unrouted)
ESC5_PH3  (1 unrouted)
ESC6_PH1  (1 unrouted)
ESC6_PH2  (1 unrouted)
ESC6_PH3  (1 unrouted)
ESC_SIG1  (2 unrouted)
ESC_SIG2  (2 unrouted)
ESC_SIG3  (2 unrouted)
ESC_SIG4  (2 unrouted)
ESC_SIG5  (2 unrouted)
ESC_SIG6  (2 unrouted)
ESC_SIG_EXP_PIN4  (1 unrouted)
ESC_SIG_EXP_PIN5  (1 unrouted)
ESC_SIG_EXP_PIN6  (1 unrouted)
ESC_SIG_PIN1  (2 unrouted)
ESC_SIG_PIN2  (2 unrouted)
ESC_SIG_PIN3  (2 unrouted)
ESC_SIG_PIN4  (2 unrouted)
ESC_SIG_PIN5  (2 unrouted)
ESC_SIG_PIN6  (2 unrouted)
GND  (57 unrouted)
  pour Top (isolate 0.508, rank 6): -1.27,-1.27 74.93,-1.27 74.93,86.36 -1.27,86.36
  pour Bottom (isolate 0.508, rank 6): 75.69,-2.03 -0.51,-2.03 -0.51,85.85 75.69,85.85
GND_RAW  (2 unrouted)
I2C_VCC  (3 unrouted)
PWM1  (1 unrouted)
PWM2  (1 unrouted)
PWM3  (1 unrouted)
SCL  (6 unrouted)
SDA  (6 unrouted)

### Text on the board
Top: TODO: CHECK THIS WITH A MEGA AND UNO (3.3V vs 5V)